# Altium schematic sheet 4ch_flyback.SchDoc
size A
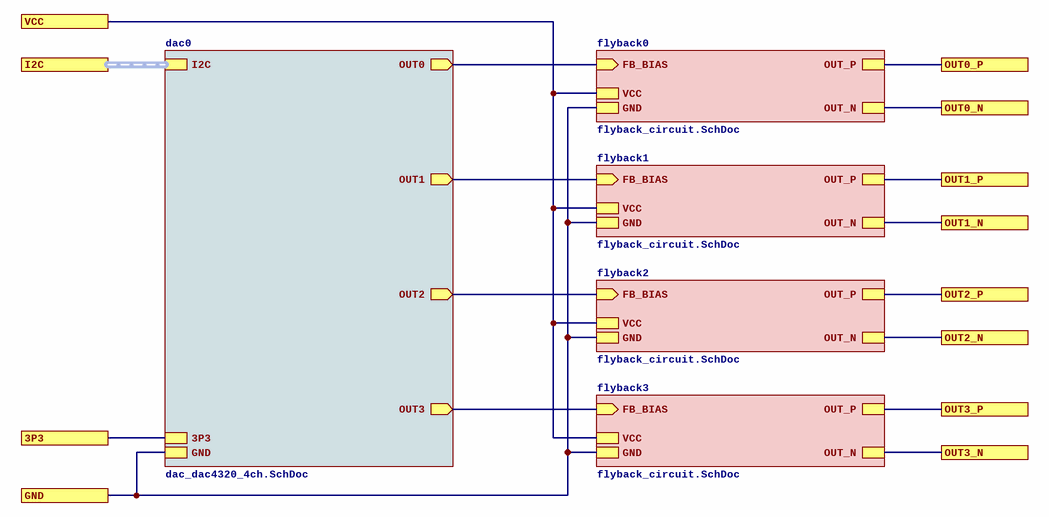
[diagram p0: 4ch_flyback.SchDoc]

## Sub-sheets
dac0 = dac_dac4320_4ch.SchDoc: I2C (harness I2C), OUT1 (out), OUT2 (out), OUT3 (out), OUT0 (out), GND, 3P3
flyback0 = flyback_circuit.SchDoc: FB_BIAS (in), GND, VCC, OUT_P, OUT_N
flyback1 = flyback_circuit.SchDoc: FB_BIAS (in), GND, VCC, OUT_P, OUT_N
flyback2 = flyback_circuit.SchDoc: FB_BIAS (in), GND, VCC, OUT_P, OUT_N
flyback3 = flyback_circuit.SchDoc: FB_BIAS (in), GND, VCC, OUT_P, OUT_N

## Ports
3P3, GND, I2C (harness I2C), OUT0_N, OUT0_P, OUT1_N, OUT1_P, OUT2_N, OUT2_P, OUT3_N, OUT3_P, VCC

## Nets
3P3: port 3P3, sheet dac0/3P3
GND: port GND, sheet flyback0/GND, sheet flyback1/GND, sheet flyback2/GND, sheet flyback3/GND, sheet dac0/GND
OUT0_N: port OUT0_N, sheet flyback0/OUT_N
OUT0_P: port OUT0_P, sheet flyback0/OUT_P
OUT1_N: port OUT1_N, sheet flyback1/OUT_N
OUT1_P: port OUT1_P, sheet flyback1/OUT_P
OUT2_N: port OUT2_N, sheet flyback2/OUT_N
OUT2_P: port OUT2_P, sheet flyback2/OUT_P
OUT3_N: port OUT3_N, sheet flyback3/OUT_N
OUT3_P: port OUT3_P, sheet flyback3/OUT_P
VCC: port VCC, sheet flyback0/VCC, sheet flyback1/VCC, sheet flyback2/VCC, sheet flyback3/VCC
(unnamed): sheet flyback0/FB_BIAS, sheet dac0/OUT0
(unnamed): sheet flyback1/FB_BIAS, sheet dac0/OUT1
(unnamed): sheet flyback2/FB_BIAS, sheet dac0/OUT2
(unnamed): sheet flyback3/FB_BIAS, sheet dac0/OUT3

## Buses and harness runs
harness port I2C = sheet dac0/I2C